# EasyEDA Pro project WEN-验证模块合集.epro, board 验证板
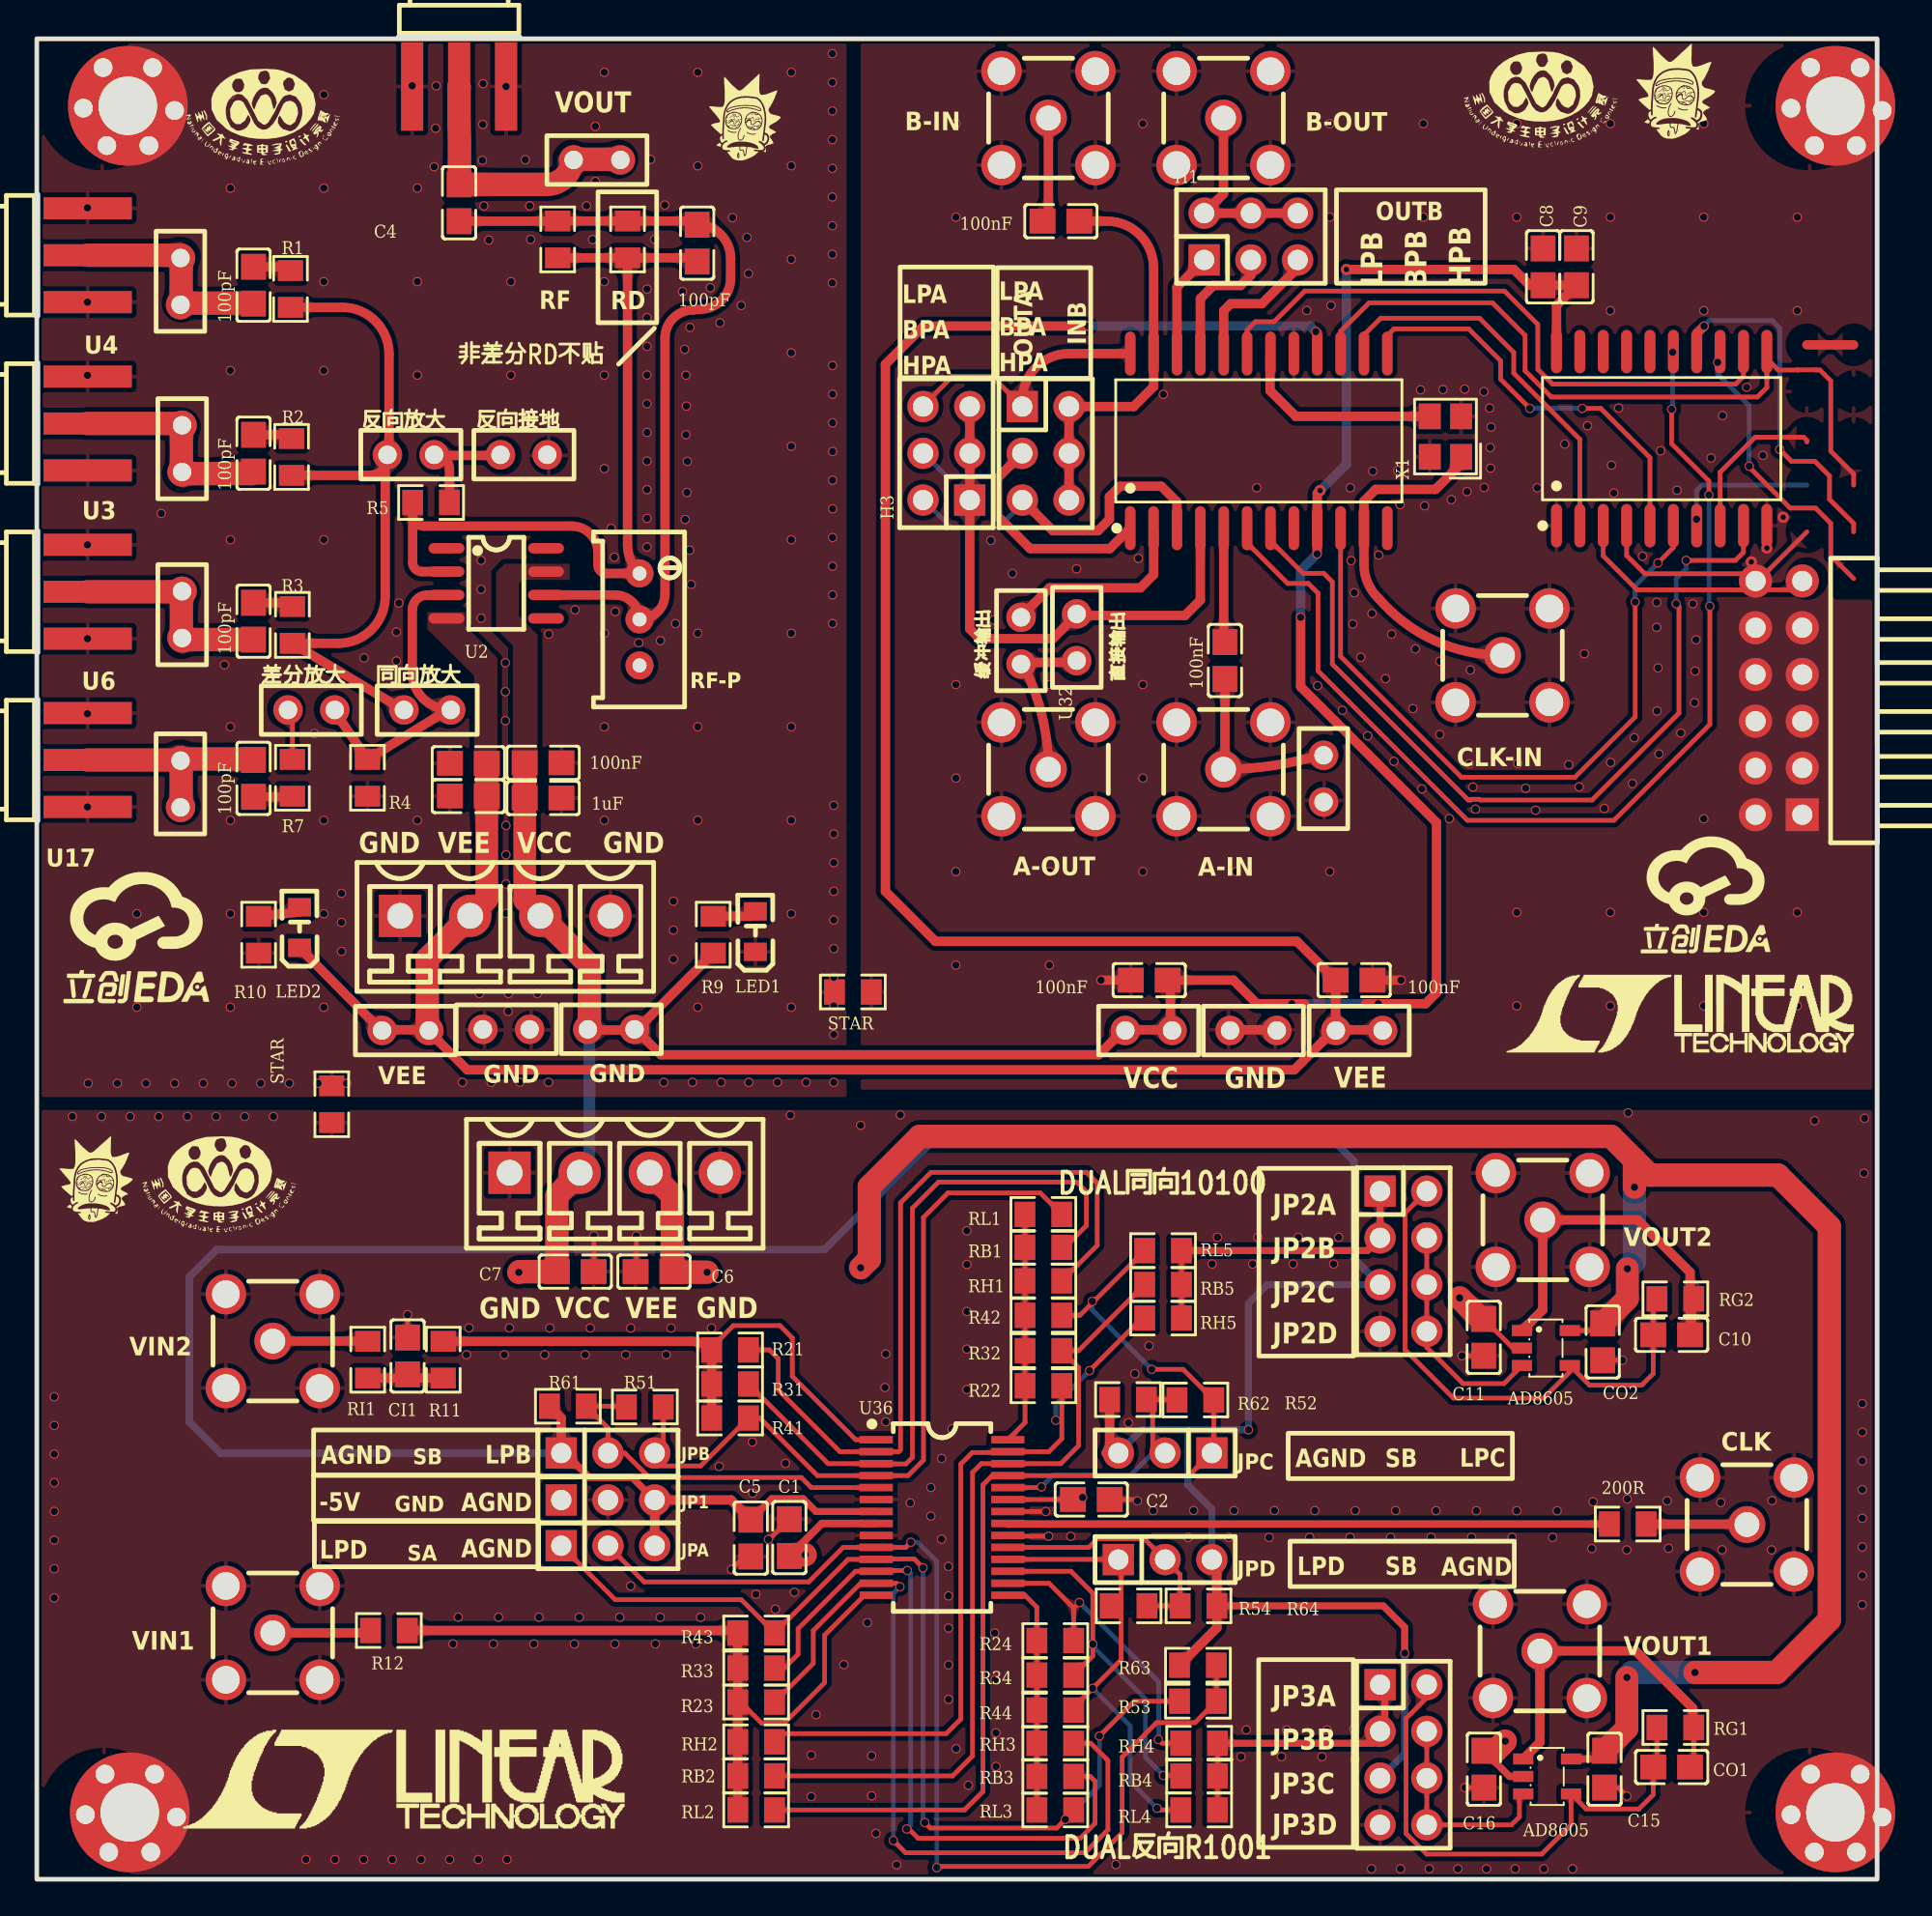
[diagram p3: board, top side]
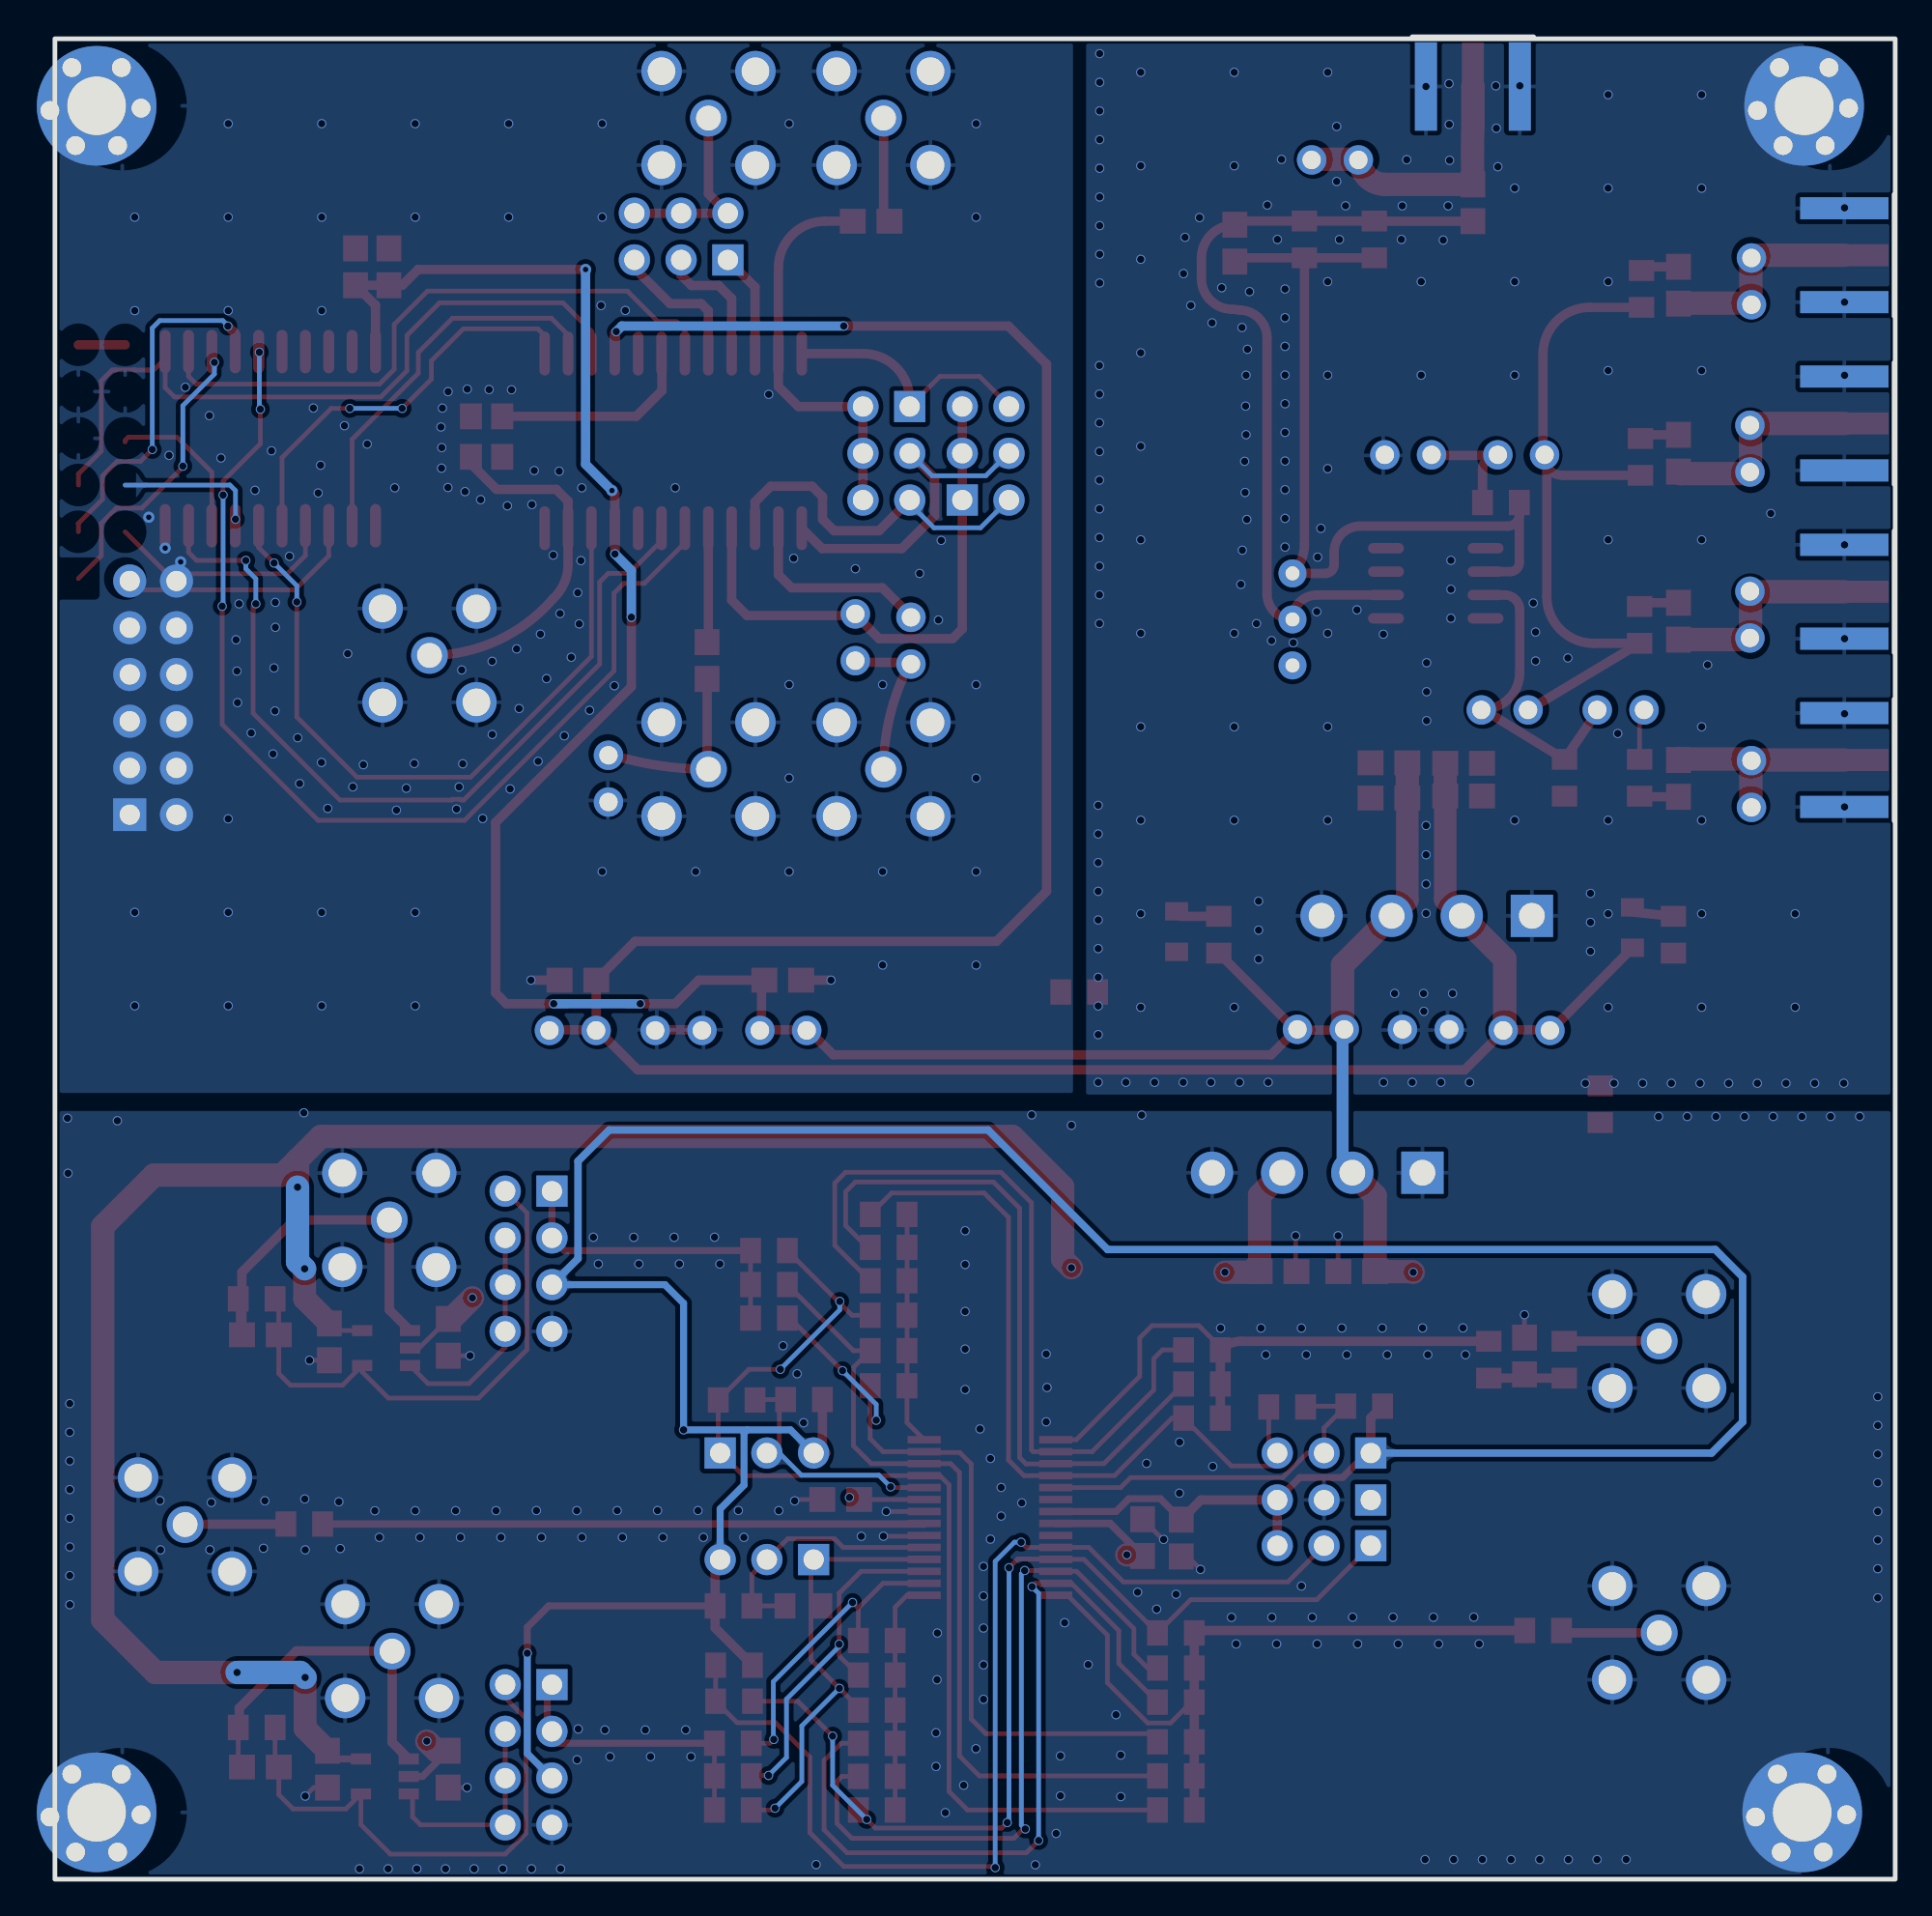
[diagram p4: board, bottom side, seen from below]

Outline 100 x 100.11 mm; copper layers: Top Layer, Inner1, Inner2, Bottom Layer. Coordinates in mm from the lower left corner of the outline.
Outline path: rectangle 0,100 100,0
Stack: Top Layer 0.035mm 外层铜厚1oz / Dielectric1 0.2104mm 7628 RC49% 8.6mil / Inner1 0.0152mm 内层铜厚 / Dielectric2 1.065mm 1.1mm H/HOZ Copper / Inner2 0.0152mm 内层铜厚 / Dielectric3 0.2104mm 7628 RC49% 8.6mil / Bottom Layer 0.035mm 外层铜厚1oz

## Design rules (mm)
template: 自定义配置
spacing copperThickness1oz (default): track to track 0.102, other pairs 0 to 0.3
spacing copperThickness2oz: track to track 0.203, other pairs 0.152 to 0.3
track width copperThickness1oz: min 0.127, default 0.254, max 2.54
track width copperThickness2oz (default): min 0.203, default 0.254, max 2.54
track width TRACE: min 0.127, default 0.508, max 2.54
differential pair differentialPair (default): width min 0.127, default 0.254, max 2.54; gap min 0.152, default 0.152
via viaSize (default): diameter min 0.5, default 0.61, max 10; hole min 0.3, default 0.305, max 6.299

## Placement (name value [footprint] x y rotation side)
1uF  1uF  [C0805]  27.51 58.75 180 top
1uF#2  1uF  [C0805]  23.45 58.86 180 top
100nF  100nF  [C0805]  27.51 60.66 180 top
100nF#2  100nF  [C0805]  23.45 60.64 180 top
100nF#3  100nF  [C0805]  60.45 48.85 180 top
100nF#4  104  [C0805]  71.58 48.85 0 top
100nF#5  100nF  [C0805]  55.65 90.09 180 top
100nF#6  -  [C0805]  64.56 66.22 90 top
100pF  100pF  [C0805]  11.78 86.61 90 top
100pF#2  100pF  [C0805]  11.78 77.48 90 top
100pF#3  100pF  [C0805]  11.78 68.36 90 top
100pF#4  100pF  [C0805]  11.78 59.81 270 top
100pF#5  100pF  [C0805]  35.88 88.9 90 top
200R  200R  [R0805]  86.45 19.3 180 top
A-IN  BWSMA-KE-Z001  [SMA-TH_BWSMA-KE-Z001]  64.48 60.31 0 top
A-OUT  BWSMA-KE-Z001  [SMA-TH_BWSMA-KE-Z001]  54.97 60.31 180 top
AD8605  -  [SOT-23-5_L3.0-W1.7-P0.95-LS2.8-BR]  82 28.86 180 top
AD8605#2  -  [SOT-23-5_L3.0-W1.7-P0.95-LS2.8-BR]  82.07 5.58 180 top
B-IN  BWSMA-KE-Z001  [SMA-TH_BWSMA-KE-Z001]  54.97 95.69 0 top
B-OUT  BWSMA-KE-Z001  [SMA-TH_BWSMA-KE-Z001]  64.48 95.69 0 top
C1  100nF  [C0805]  40.89 18.56 270 top
C2  100nF  [C0805]  57.3 20.63 180 top
C4  100pF  [C0805]  22.95 91.09 90 top
C5  10uF  [C0805]  38.8 18.54 270 top
C6  10uF  [C0805]  33.54 33.01 0 top
C7  10uF  [C0805]  29.26 33.01 0 top
C8  104  [C0805]  81.85 87.61 90 top
C9  106  [C0805]  83.67 87.61 90 top
C10  100nF  [C0805]  85.09 29.2 270 top
C11  100nF  [C0805]  78.62 29.44 270 top
C15  100nF  [C0805]  85.19 5.98 270 top
C16  100nF  [C0805]  78.63 5.98 270 top
CI1  100nF  [C0805]  20.15 28.43 270 top
CLK  BWSMA-KE-Z001  [SMA-TH_BWSMA-KE-Z001]  92.93 19.27 270 top
CLK-IN  BWSMA-KE-Z001  [SMA-TH_BWSMA-KE-Z001]  79.65 66.5 180 top
CN1  WJ15EDGVC-3.81-4P  [CONN-TH_4P-P3.81_WJ2EDGVC-3.81-4P]  25.46 52.34 0 top
CN3  WJ15EDGVC-3.81-4P  [CONN-TH_4P-P3.81_WJ2EDGVC-3.81-4P]  31.41 38.39 0 top
CO1  100nF  [C0805]  88.84 6.09 0 top
CO2  100nF  [C0805]  88.84 29.58 0 top
GND  -  [2P-2.54]  31.3 46.14 180 top
GND#2  -  [2P-2.54]  25.6 46.14 180 top
GND#3  -  [HDR-TH_3P-P2.54-V-M]  31.04 20.6 0 top
H1  PZ254V-12-6P  [HDR-TH_6P-P2.54-V-M-R2-C3-S2.54]  65.97 89.25 0 top
H3  PZ254V-12-6P  [HDR-TH_6P-P2.54-V-M-R2-C3-S2.54]  49.43 77.48 90 top
H4  PZ254V-12-8P  [HDR-TH_8P-P2.54-V-M-R2-C4-S2.54]  74.26 33.58 270 top
H6  PZ254V-12-8P  [HDR-TH_8P-P2.54-V-M-R2-C4-S2.54]  74.26 6.76 270 top
JPC  PZ254V-11-03P  [HDR-TH_3P-P2.54-V-M]  61.31 23.16 180 top
JPD  PZ254V-11-03P  [HDR-TH_3P-P2.54-V-M]  61.31 17.37 0 top
LED1  -  [LED_0805]  39.05 51.54 90 top
LED2  -  [LED_0805]  14.28 51.76 90 top
M1  max262  [SOIC-24_L15.4-W7.5-P1.27-LS10.3-BL]  66.4 78.15 0 top
N1  74HC373  [SOIC-20_L13.0-W7.6-P1.27-LS10.3-BL]  88.29 78.27 0 top
P2  Header 3X2  [HDR-TH_6P-P2.54-V-M-R2-C3-S2.54]  54.82 77.48 270 top
R1  1k  [R0805]  13.78 86.41 270 top
R2  1k  [R0805]  13.84 77.28 270 top
R3  1k  [R0805]  13.89 68.15 270 top
R4  1k  [R0805]  17.97 59.85 90 top
R5  1k  [R0805]  21.42 74.8 0 top
R7  1k  [R0805]  13.89 59.85 90 top
R9  1k  [R0805]  36.76 51.32 270 top
R10  1k  [R0805]  12.05 51.32 270 top
R11  1k  [R0805]  22.08 28.23 90 top
R12  1k  [R0805]  19.13 13.51 0 top
R21  1k  [R0805]  37.67 28.76 0 top
R22  1k  [R0805]  54.7 26.81 180 top
R23  1k  [R0805]  39.09 9.62 0 top
R24  1k  [R0805]  55.34 12.97 180 top
R31  1k  [R0805]  37.67 26.91 0 top
R32  1k  [R0805]  54.7 28.72 180 top
R33  1k  [R0805]  39.09 11.47 0 top
R34  1k  [R0805]  55.34 11.09 180 top
R41  1k  [R0805]  37.67 25.06 0 top
R42  1k  [R0805]  54.7 30.64 180 top
R43  1k  [R0805]  39.09 13.38 0 top
R44  1k  [R0805]  55.34 9.19 180 top
R51  1k  [R0805]  33.04 25.66 0 top
R52  1k  [R0805]  62.96 26.04 0 top
R53  1k  [R0805]  63.1 9.67 0 top
R54  1k  [R0805]  59.33 14.85 0 top
R61  1k  [R0805]  28.86 25.7 0 top
R62  1k  [R0805]  59.3 26.06 180 top
R63  1k  [R0805]  63.1 11.63 0 top
R64  1k  [R0805]  63.13 14.85 0 top
RB1  1k  [R0805]  54.69 34.33 180 top
RB2  1k  [R0805]  39.09 5.61 0 top
RB3  1k  [R0805]  55.34 5.58 180 top
RB4  1k  [R0805]  63.16 5.61 0 top
RB5  1k  [R0805]  61.2 32.31 0 top
RD  1k  [R0805]  32.1 89.1 90 top
RF  10k  [R0805]  28.3 89.1 90 top
RF-P  10kΩ  [RES-ADJ-TH_3P-L10.0-W10.0-P2.50-L]  32.75 68.45 270 top
RG1  1k  [R0805]  89.04 8.24 0 top
RG2  1k  [R0805]  89.04 31.53 0 top
RH1  1k  [R0805]  54.69 32.51 180 top
RH2  1k  [R0805]  39.09 7.46 0 top
RH3  1k  [R0805]  55.34 7.38 180 top
RH4  1k  [R0805]  63.16 7.39 0 top
RH5  1k  [R0805]  61.2 30.49 0 top
RI1  1k  [R0805]  17.98 28.23 270 top
RL1  1k  [R0805]  54.69 36.12 180 top
RL2  1k  [R0805]  39.09 3.76 0 top
RL3  1k  [R0805]  55.34 3.76 180 top
RL4  1k  [R0805]  63.16 3.76 0 top
RL5  1k  [R0805]  61.2 34.16 0 top
SA  PZ254V-11-03P  [HDR-TH_3P-P2.54-V-M]  31.04 18.12 0 top
SB  PZ254V-11-03P  [HDR-TH_3P-P2.54-V-M]  31.04 23.16 0 top
STAR  -  [R0805]  44.34 48.21 0 top
STAR#2  -  [R0805]  16.03 42.11 90 top
U2  OPA690IDR  [SOIC-8_L5.0-W4.0-P1.27-LS6.0-BL]  24.96 70.41 270 top
U3  -  [SMA-SMD_BWSMA-KE-P001]  2.76 79.1 180 top
U4  -  [SMA-SMD_BWSMA-KE-P001]  2.76 88.24 180 top
U6  -  [SMA-SMD_BWSMA-KE-P001]  2.76 69.96 180 top
U7  -  [SMA-SMD_BWSMA-KE-P001]  22.95 97.41 90 top
U8  -  [2P-2.54]  30.35 93.45 0 top
U12  -  [2P-2.54]  7.85 86.91 270 top
U14  -  [2P-2.54]  7.86 68.63 90 top
U15  -  [2P-2.54]  7.86 77.64 90 top
U17  -  [SMA-SMD_BWSMA-KE-P001]  2.76 60.81 180 top
U18  -  [2P-2.54]  7.85 59.6 270 top
U24  -  [My_M3螺丝孔]  96.34 96.36 0 top
U25  -  [My_M3螺丝孔]  96.34 3.63 0 top
U26  -  [My_M3螺丝孔]  3.65 3.63 0 top
U27  -  [My_M3螺丝孔]  3.55 96.36 0 top
U28  -  [2P-2.54]  60.33 46.15 0 top
U29  -  [2P-2.54]  66.02 46.15 0 top
U30  -  [2P-2.54]  71.77 46.15 0 top
U32  -  [2P-2.54]  69.96 59.89 270 top
U33  -  [PMOD2X6P-2.54mm]  98.73 70.67 90 top
U36  -  [SSOP-28_L10.2-W5.3-P0.65-LS7.8-TL]  49.19 19.65 0 top
VEE  -  [2P-2.54]  19.95 46.15 0 top
VIN1  BWSMA-KE-Z001  [SMA-TH_BWSMA-KE-Z001]  12.82 13.38 0 top
VIN2  BWSMA-KE-Z001  [SMA-TH_BWSMA-KE-Z001]  12.82 29.24 0 top
VOUT1  BWSMA-KE-Z001  [SMA-TH_BWSMA-KE-Z001]  81.68 12.39 0 top
VOUT2  BWSMA-KE-Z001  [SMA-TH_BWSMA-KE-Z001]  81.83 35.82 0 top
X1  12MHz  [CRYSTAL-SMD_4P-L3.2-W2.5-BL]  76.55 78.39 90 top
反向接地  -  [2P-2.54]  26.55 77.36 180 top
反向放大  -  [2P-2.54]  20.41 77.36 180 top
同向放大  -  [2P-2.54]  21.13 63.57 0 top
差分放大  -  [2P-2.54]  14.83 63.57 0 top
直接输出  -  [2P-2.54]  56.47 67.39 90 top
缓冲输出  -  [2P-2.54]  53.52 67.38 270 top

## Footprints (pads in the part's own frame, mm; a bottom-side part is the same pattern mirrored in y, then rotated)
2P-2.54
  round 1.6 hole 1: 1(1.357,-0.036) 2(-1.183,-0.036)
C0805
  rect 1.41x1.35 smd: 1(-1,0) 2(1,0)
CONN-TH_4P-P3.81_WJ2EDGVC-3.81-4P
  rect 2.3x2.3 hole 1.4: 1(-5.715,0)
  round 2.3 hole 1.4: 2(-1.905,0) 3(1.905,0) 4(5.715,0)
CRYSTAL-SMD_4P-L3.2-W2.5-BL
  rect 1.4x1.2 smd: 1(-1.1,-0.85) 2(1.1,-0.85) 3(1.1,0.85) 4(-1.1,0.85)
HDR-TH_3P-P2.54-V-M
  rect 1.7x1.7 hole 1.1: 1(-2.54,0)
  round 1.7 hole 1.1: 2(0,0) 3(2.54,0)
HDR-TH_6P-P2.54-V-M-R2-C3-S2.54
  rect 1.7x1.7 hole 1.1: 1(-2.54,-1.27)
  round 1.7 hole 1.1: 2(-2.54,1.27) 3(0,-1.27) 4(0,1.27) 5(2.54,-1.27) 6(2.54,1.27)
HDR-TH_8P-P2.54-V-M-R2-C4-S2.54
  rect 1.7x1.7 hole 1.1: 1(-3.81,-1.27)
  round 1.7 hole 1.1: 2(-3.81,1.27) 3(-1.27,-1.27) 4(-1.27,1.27) 5(1.27,-1.27) 6(1.27,1.27) 7(3.81,-1.27) 8(3.81,1.27)
LED_0805
  rect 1x1.25 smd: 1(-1.15,0.005) 2(1.05,0.005)
My_M3螺丝孔
  round 1.016 hole 1.021x1.016: 1(-1.016,-0.127) 1(0.051,2.078) 1(0.254,-2.159) 1(2.54,-2.159) 1(2.743,2.078) 1(3.937,-0.254)
  round 6.5 hole 3.18x3.175: 1(1.397,0)
PMOD2X6P-2.54mm
  rect 1.778x1.8 hole 1.1: 1(-12.832,2.791)
  round 1.8 hole 1.1: 2(-12.832,5.331) 3(-10.293,2.791) 4(-10.293,5.331) 5(-7.753,2.791) 6(-7.753,5.331) 7(-5.213,2.791) 8(-5.213,5.331) 9(-2.672,2.791) 10(-2.672,5.331) 11(-0.133,2.791) 12(-0.133,5.331)
R0805
  rect 1.133x1.377 smd: 1(-1,0) 2(1,0)
RES-ADJ-TH_3P-L10.0-W10.0-P2.50-L
  round 1.524 hole 0.762: 1(-2.5,0) 2(0,0) 3(2.5,0)
SMA-SMD_BWSMA-KE-P001
  rect 4.8x1.2 smd: 1(0,-2.55) 2(0,2.55) 5(0,0)
  rect 4.8x1.2 smd far side: 3(0,2.55) 4(0,-2.55)
SMA-TH_BWSMA-KE-Z001
  round 2.2 hole 1.5: 1(-2.55,-2.55) 2(-2.55,2.55) 3(2.55,2.55) 4(2.55,-2.55)
  round 2 hole 1.35: 5(0,0)
SOIC-8_L5.0-W4.0-P1.27-LS6.0-BL
  oval 0.569x1.95 smd: 1(-1.905,-2.705) 2(-0.635,-2.705) 3(0.635,-2.705) 4(1.905,-2.705) 5(1.905,2.705) 6(0.635,2.705) 7(-0.635,2.705) 8(-1.905,2.705)
SOIC-20_L13.0-W7.6-P1.27-LS10.3-BL
  oval 0.595x2.36 smd: 1(-5.715,-4.73) 2(-4.445,-4.73) 3(-3.175,-4.73) 4(-1.905,-4.73) 5(-0.635,-4.73) 6(0.635,-4.73) 7(1.905,-4.73) 8(3.175,-4.73) 9(4.445,-4.73) 10(5.715,-4.73) 11(5.715,4.73) 12(4.445,4.73) 13(3.175,4.73) 14(1.905,4.73) 15(0.635,4.73) 16(-0.635,4.73) 17(-1.905,4.73) 18(-3.175,4.73) 19(-4.445,4.73) 20(-5.715,4.73)
SOIC-24_L15.4-W7.5-P1.27-LS10.3-BL
  oval 0.574x2.388 smd: 1(-6.985,-4.744) 2(-5.715,-4.744) 3(-4.445,-4.744) 4(-3.175,-4.744) 5(-1.905,-4.744) 6(-0.635,-4.744) 7(0.635,-4.744) 8(1.905,-4.744) 9(3.175,-4.744) 10(4.445,-4.744) 11(5.715,-4.744) 12(6.985,-4.744) 13(6.985,4.744) 14(5.715,4.744) 15(4.445,4.744) 16(3.175,4.744) 17(1.905,4.744) 18(0.635,4.744) 19(-0.635,4.744) 20(-1.905,4.744) 21(-3.175,4.744) 22(-4.445,4.744) 23(-5.715,4.744) 24(-6.985,4.744)
SOT-23-5_L3.0-W1.7-P0.95-LS2.8-BR
  rect 1.1x0.6 smd: 1(1.3,-0.95) 2(1.3,0) 3(1.3,0.95) 4(-1.3,0.95) 5(-1.3,-0.95)
SSOP-28_L10.2-W5.3-P0.65-LS7.8-TL
  rect 1.804x0.406 smd: 1(-3.575,4.225) 2(-3.575,3.575) 3(-3.575,2.925) 4(-3.575,2.275) 5(-3.575,1.625) 6(-3.575,0.975) 7(-3.575,0.325) 8(-3.575,-0.325) 9(-3.575,-0.975) 10(-3.575,-1.625) 11(-3.575,-2.275) 12(-3.575,-2.925) 13(-3.575,-3.575) 14(-3.575,-4.225) 15(3.575,-4.225) 16(3.575,-3.575) 17(3.575,-2.925) 18(3.575,-2.275) 19(3.575,-1.625) 20(3.575,-0.975) 21(3.575,-0.325) 22(3.575,0.325) 23(3.575,0.975) 24(3.575,1.625) 25(3.575,2.275) 26(3.575,2.925) 27(3.575,3.575) 28(3.575,4.225)

## Nets
3V3: U33.11 U33.12
+5V: 1uF.2 100nF.2 100nF#3.1 AD8605.5 AD8605#2.5 C1.2 C7.1 C8.1 C9.1 C10.1 C15.1 CN1.3 CN3.2 GND.1 GND.2 M1.9 N1.20 R9.2 U2.7 U28.1 U28.2 U36.8
-5V: 1uF#2.1 100nF#2.1 100nF#4.1 AD8605.2 AD8605#2.2 C2.2 C6.2 C11.1 C16.1 CN1.2 CN3.3 GND#3.1 LED2.1 M1.16 U2.4 U30.1 U30.2 U36.23 VEE.1 VEE.2
AGND: C5.1 GND#3.3 H4.5 H6.5 JPC.3 JPD.3 R61.1 R62.2 R63.1 R64.2 SA.3 SB.1 U36.7
GND: 1uF.1 1uF#2.2 100nF.1 100nF#2.2 100nF#3.2 100nF#4.2 A-IN.1 A-IN.2 A-IN.3 A-IN.4 A-OUT.1 A-OUT.2 A-OUT.3 A-OUT.4 B-IN.1 B-IN.2 B-IN.3 B-IN.4 B-OUT.1 B-OUT.2 B-OUT.3 B-OUT.4 C1.1 C2.1 C5.2 C6.1 C7.2 C8.2 C9.2 C10.2 C11.2 C15.2 C16.2 CI1.1 CLK.1 CLK.2 CLK.3 CLK.4 CLK-IN.1 CLK-IN.2 CLK-IN.3 CLK-IN.4 CN1.1 CN1.4 CN3.1 CN3.4 GND#2.1 GND#2.2 GND#3.2 H4.7 H6.7 LED1.1 M1.17 N1.1 N1.10 R4.1 R10.2 STAR.1 STAR.2 STAR#2.1 STAR#2.2 U3.1 U3.2 U3.3 U3.4 U4.1 U4.2 U4.3 U4.4 U6.1 U6.2 U6.3 U6.4 U7.1 U7.2 U7.3 U7.4 U17.1 U17.2 U17.3 U17.4 U24.1 U25.1 U26.1 U27.1 U29.1 U29.2 U32.1 U33.7 U33.9 U33.10 U36.6 U36.9 U36.20 U36.22 VIN1.1 VIN1.2 VIN1.3 VIN1.4 VIN2.1 VIN2.2 VIN2.3 VIN2.4 VOUT1.1 VOUT1.2 VOUT1.3 VOUT1.4 VOUT2.1 VOUT2.2 VOUT2.3 VOUT2.4 X1.2 X1.4 反向接地.2
VIN1: R12.1 VIN1.5
VIN2: RI1.1 VIN2.5
A0: M1.14 N1.2
A1: M1.13 N1.5
A2: M1.10 N1.6
A3: M1.7 N1.9
D0: M1.19 N1.12
D1: M1.6 N1.15
IN-D0: N1.3 U33.2
IN-D1: N1.4 U33.4
IN-D2: N1.7 U33.6
IN-D3: N1.8 U33.8
IN-D4: N1.13 U33.1
IN-D5: N1.14 U33.3
IN-WR: M1.15 N1.11 U33.5
OP-IN: H3.1 H3.3 H3.5 M1.4 直接输出.1
OP-OUT: M1.2 缓冲输出.2
$1N2485: 100pF#5.1 R5.1 RD.1 RF.1 RF-P.1 U2.2
$1N2698: 100pF.1 U4.5 U12.1 U12.2
$1N2704: 100pF.2 R1.1
$1N2710: 100pF#2.2 R2.1
$1N2715: 100pF#2.1 U3.5 U15.1 U15.2
$1N2721: 100pF#3.1 U6.5 U14.1 U14.2
$1N2730: 100pF#3.2 R3.1
$1N2778: R4.2 U2.3 同向放大.1 差分放大.1
$1N2863: R5.2 反向接地.1 反向放大.2
$1N2871: R1.2 R2.2 R3.2 反向放大.1 同向放大.2
$1N3268: C4.2 U7.5 U8.1 U8.2
$1N3280: 100pF#5.2 C4.1 RD.2 RF.2 RF-P.2 U2.6
$1N3511: 100pF#4.1 U17.5 U18.1 U18.2
$1N3515: 100pF#4.2 R7.1
$1N3520: R7.2 差分放大.2
$1N3998: LED1.2 R9.1
$1N4082: LED2.2 R10.1
$2N1385: H3.2 M1.3 P2.5
$2N1386: H3.6 M1.24 P2.1
$2N1387: H3.4 M1.1 P2.3
$2N1398: H1.5 M1.20
$2N1399: H1.3 M1.21
$2N1463: M1.18 X1.3
$2N4736: H1.1 M1.22
$2N4759: B-OUT.5 H1.2 H1.4 H1.6
$2N7298: A-OUT.5 直接输出.2 缓冲输出.1
$2N7530: 100nF#5.2 B-IN.5
$2N7539: 100nF#5.1 M1.23 P2.2 P2.4 P2.6
$2N7543: CLK-IN.5 M1.11 X1.1
$2N8327: 100nF#6.1 A-IN.5 U32.2
$2N8341: 100nF#6.2 M1.5
$3N1782: R22.2 R32.2 R42.2 RB1.2 RH1.2 RL1.2 U36.28
$3N1872: JPC.1 R42.1 R52.2 RL2.2 RL5.1 U36.25
$3N1876: R32.1 RB2.2 RB5.1 U36.26
$3N1878: R22.1 RH2.2 RH5.1 U36.27
$3N2477: AD8605.1 CO2.2 RG2.2 VOUT2.5
$3N2576: AD8605.4 CO2.1 H4.2 RG2.1
$3N2792: H4.1 H4.3 RB5.2 RH5.2 RL5.2
$3N2807: AD8605.3 H4.4 H4.6 H4.8
$3N3003: R21.2 RH1.1 U36.2
$3N3008: R31.2 RB1.1 U36.3
$3N3018: R41.2 R51.2 RL1.1 SB.3 U36.4
$3N3022: R11.2 R21.1 R31.1 R41.1 U36.1
$3N3099: CI1.2 R11.1 RI1.2
$3N3340: R51.1 R61.2 SB.2 U36.5
$3N3779: R53.2 R63.2 SA.2 U36.10
$3N4162: R43.2 R53.1 RL3.1 SA.1 U36.11
$3N4167: R33.2 RB3.1 U36.12
$3N4172: R23.2 RH3.1 U36.13
$3N4596: R24.2 R34.2 R44.2 RB3.2 RH3.2 RL3.2 U36.15
$3N4603: JPD.1 R44.1 R54.1 RL4.1 U36.18
$3N4605: R24.1 RH4.1 U36.16
$3N4661: R34.1 RB4.1 U36.17
$3N4969: 200R.2 U36.21
$3N4977: JPD.2 R54.2 R64.1 U36.19
$3N5437: AD8605#2.1 CO1.2 RG1.2 VOUT1.5
$3N5450: AD8605#2.4 CO1.1 H6.2 RG1.1
$3N5465: AD8605#2.3 H6.4 H6.6 H6.8
$3N5493: H6.1 H6.3 RB4.2 RH4.2 RL4.2
$3N5834: 200R.1 CLK.5
$3N6100: JPC.2 R52.1 R62.1 U36.24
$3N6540: R12.2 R23.1 R33.1 R43.1 RB2.1 RH2.1 RL2.1 U36.14

Pads without a net: M1 8 12; N1 16 17 18 19; RF-P 3; U2 1 5 8

## Via types
v1: diameter 0.5, hole 0.4, Top Layer to Bottom Layer, 545 vias
v2: diameter 0.61, hole 0.305, Top Layer to Bottom Layer, 5 vias

## Routing (per net, layer and track width the routed paths; a pad name or vN(x,y) marks a point on that pad's centre or on a via; arc(x,y) is an arc through that point)
3V3: length 2.5
  Top Layer w0.508: 96.19,83.37 98.73,83.37
+5V: length 303.6
  Top Layer w0.254: AD8605.5 84.7,29.81 C10.1
  Top Layer w0.381: 83.37,6.53 84.74,6.53 C15.1
  Top Layer w0.406: U36.8 42.66,19.33 40.96,17.63
  Top Layer w0.508: 32.57,46.14 32.58,46.14 R9.2 ; 32.57,46.14 30.03,46.14 ; 32.57,46.14 33.91,44.8 57.71,44.8 59.06,46.15 61.6,46.15 61.6,48.7 100nF#3.1 65.02,48.85 66.3,47.57 v1(68.19,47.57) 68.89,47.57 ; v2(69.73,75.45) 69.58,75.3 M1.9 69.57,73.4 v1(69.57,72.01) ; N1.20 82.58,85.52 C9.1 C8.1 81.12,86.61 80.26,87.47 v2(71.16,87.47) ; v1(68.68,68.57) 68.68,64.8 76.06,57.42 76.06,48.16 75.46,47.57 v1(72.9,47.57) 72.21,47.57
  Top Layer w1.23: CN1.3 26.51,53.2 1uF.2
  Top Layer w1.244: C10.1 86.43,31.54 v1(86.43,33.17) ; C15.1 86.4,8.19 v1(86.4,10.96)
  Top Layer w1.27: v1(41.75,17.63) 40.96,17.63 C1.2 ; 86.81,39.09 85.55,40.36 47.97,40.36 45.24,37.62 45.24,33.69 v1(44.77,33.22) ; 86.81,39.09 87.64,38.26 94.61,38.26 97.4,35.47 97.4,14.1 94.54,11.23 v1(90.1,11.23) ; 86.81,39.09 v1(86.81,37.6) ; 30.03,46.14 30.03,49.68 CN1.3 ; CN3.2 28.26,37.14 C7.1 26.23,33.01 v1(26.19,32.97) ; 1uF.2 100nF.2
  Inner2 w1.27: v1(26.19,32.97) 28.04,31.13 42.67,31.13 ; 42.67,31.13 42.98,31.13 43.99,30.12 43.99,19.86 v1(41.75,17.63) ; 42.67,31.13 v1(44.77,33.22)
  Bottom Layer w0.508: v1(68.19,47.57) v1(72.9,47.57) ; v2(69.73,75.45) 71.16,76.89 v2(71.16,87.47) ; v1(69.57,72.01) 68.68,71.12 v1(68.68,68.57)
  Bottom Layer w0.65: CN3.2 30.03,38.91 30.03,46.14
  Bottom Layer w1.27: v1(86.81,37.6) 86.81,33.55 v1(86.43,33.17) ; v1(86.4,10.96) 86.67,11.23 v1(90.1,11.23)
-5V: length 415.1
  Top Layer w0.254: 52.77,20.63 56.3,20.63 C2.2 ; AD8605.2 80.21,28.86 C11.1
  Top Layer w0.381: AD8605#2.2 80.03,5.58 C16.1
  Top Layer w0.508: 70.5,46.15 70.58,46.23 100nF#4.1 68.47,50.96 48.83,50.96 46.11,53.68 46.11,82.32 48.19,84.39 v1(57.13,84.39) ; 70.5,46.15 73.04,46.15 ; 70.5,46.15 68.33,43.98 23.39,43.98 21.22,46.15 18.68,46.15 LED2.1 ; v1(69.5,84.09) 69.58,84.01 M1.16
  Top Layer w1.23: 1uF#2.1 24.45,53.24 CN1.2
  Top Layer w1.27: C11.1 78.46,30.44 v1(77.31,31.59) ; CN1.2 21.22,50.01 21.22,46.15 ; v1(79.79,7.5) 79.76,7.47 arc(79.66,7.39) 79.58,7.3 79.27,6.98 C16.1 ; v1(36.42,32.98) 34.57,32.98 C6.2 34.54,37.16 CN3.3 ; 1uF#2.1 100nF#2.1
  Inner2 w0.65: 21.22,46.15 21.22,40.64
  Inner2 w1.27: v1(79.79,7.5) 80.24,7.96 85.31,7.96 86.73,9.38 96.34,9.38 98.15,11.19 98.15,37.5 95.05,40.61 78.44,40.61 77.68,39.85 76.38,39.85 ; 44.42,39.18 45.08,39.85 56.98,39.85 57.03,39.8 ; 44.42,39.18 38.22,32.98 v1(36.42,32.98) ; 44.42,39.18 43.24,40.36 4.02,40.36 2.47,38.8 2.47,21.82 3.68,20.6 GND#3.1 ; 76.38,39.85 76.38,39.8 57.03,39.8 ; 76.38,39.85 77.31,38.91 v1(77.31,31.59) ; 57.03,39.8 58.45,38.38 58.45,27.03 56.83,25.41 v1(56.83,20.74)
  Bottom Layer w0.508: v1(57.13,84.39) 69.2,84.39 v1(69.5,84.09)
AGND: length 186.9
  Top Layer w0.381: R64.2 73.17,14.85 74.33,13.69 v1(74.33,12.28) ; SB.1 28.7,23.16 30.03,21.82 32.36,21.82 GND#3.3 ; C5.1 39.93,20.67 41.64,20.67 42.34,19.98 U36.7
  Top Layer w0.508: 58.1,23.16 58.3,23.35 R62.2 ; R61.1 28.5,25.06 SB.1 ; C5.1 37.73,20.6 GND#3.3 SA.3 ; JPD.3 64.13,17.09 R64.2 64.13,13.66 R63.1
  Bottom Layer w0.381: H6.5 74.33,6.83 v1(74.33,12.28) ; 62.38,24.41 v1(65.84,24.41) 65.84,31.29 66.85,32.31 H4.5 ; 62.38,24.41 60.03,24.41 JPC.3 ; 62.38,24.41 62.55,24.24 62.55,21.42 63.85,20.12 JPD.3
  Bottom Layer w0.406: SB.1 9.98,23.16 8.29,24.84 8.29,32.73 9.78,34.21 42.8,34.21 49.29,40.71 69.88,40.71 71.58,39.02 71.58,33.72 H4.5
GND: length 25.5
  Top Layer w0.254: C2.1 59.73,20.63 v1(59.8,20.56) ; C6.1 32.58,33.06 v1(32.58,34.96) ; C15.2 85.94,4.98 v1(86.4,4.51) ; C5.2 38.52,17.26 38.18,17.26 v1(37.75,16.83) ; v1(39.75,18.46) 39.79,18.46 C1.1 ; C16.2 v1(77.61,4.98) ; 52.77,18.68 52.81,18.64 v1(54.98,18.64) ; CI1.1 v1(20.15,30.67) ; C10.2 v1(86.16,28.2) ; v1(30.27,34.96) 30.27,33.03 C7.2 ; C11.2 v1(77.44,28.44) ; 52.77,19.98 v1(54.83,19.98)
  Top Layer w0.508: 100nF#4.2 v1(74.13,48.85) ; 64.75,46.15 67.29,46.15 ; N1.10 v2(94.01,72.33) ; 100nF#3.2 v1(57.83,48.85)
  vias: v1(0.95,26.22) v1(0.95,24.66) v1(0.95,23.1) v1(0.95,21.54) v1(0.95,19.98) v1(0.95,18.43) v1(0.95,16.87) v1(0.95,15.29) v1(1.93,41.44) v1(2.75,90.82) v1(2.75,85.69) v1(2.75,81.72) v1(2.75,72.51) v1(2.75,67.41) v1(2.75,63.33) v1(2.75,58.26) v1(2.79,43.25) v1(3.51,41.44) v1(4.38,43.25) v1(5.07,41.44) v1(5.44,52.46) v1(5.44,47.38) v1(5.93,43.25) v1(6.63,41.44) v1(6.76,74.21) v1(7.49,43.25) v1(8.18,41.44) v1(9.05,43.25) v1(9.74,41.44) v1(10.2,65.98) v1(10.52,96.96) v1(10.52,91.88) v1(10.52,81.97) v1(10.52,72.78) v1(10.52,62.62) v1(10.52,57.54) v1(10.52,52.46) v1(10.52,47.38) v1(10.61,43.25) v1(11.3,41.44) v1(12.16,43.25) v1(12.86,41.44) v1(13.72,43.25) v1(14.62,1.07) v1(15.08,62.25) v1(15.28,43.25) v1(15.6,96.96) v1(15.6,91.88) v1(15.6,86.8) v1(15.6,81.97) v1(15.6,72.78) v1(15.6,57.54) v1(15.6,52.46) v1(15.6,47.38) v1(16.2,1.07) v1(16.56,53.57) v1(16.56,51.99) v1(16.56,50.42) v1(16.84,43.25) v1(17.79,66.36) v1(17.76,1.07) v1(19.32,1.07) v1(19.54,67.77) v1(19.54,66.19) v1(19.67,69.34) v1(20.4,97.45) v1(20.68,91.88) v1(20.68,86.8) v1(20.68,81.72) v1(20.68,57.54) v1(20.88,1.07) v1(21.59,93.05) v1(21.67,95.14) v1(21.7,97.45) v1(22.43,1.07) v1(22.61,12.78) v1(22.9,14.24) v1(23.13,43.3) v1(23.35,28.5) v1(23.49,29.96) v1(23.99,1.07) v1(24.05,48.13) v1(24.14,71.66) v1(24.14,70.09) v1(24.14,68.51) v1(24.24,97.56) v1(24.23,95.35) v1(24.21,93.4) v1(24.29,90.92) v1(24.56,89.06) v1(24.69,43.3) v1(24.81,12.78) v1(25.09,14.24) v1(25.4,28.5) v1(25.5,97.41) v1(25.46,66.1) v1(25.46,64.52) v1(25.46,62.95) v1(25.49,57.25) v1(25.49,55.66) v1(25.49,54.07) v1(25.49,52.48) v1(25.55,1.07) v1(25.63,48.13) v1(25.61,47.16) v1(25.68,29.95) v1(25.76,86.8) v1(25.76,81.72) v1(26.25,43.3) v1(26.54,93.43) v1(26.78,90.92) v1(26.83,89.1) v1(27.01,12.78) v1(27.2,48.13) v1(27.29,14.24) v1(27.6,28.5) v1(27.8,43.3) v1(27.81,67.65) v1(27.88,29.95) v1(29.25,68.97) v1(29.21,12.78) v1(29.48,14.24) v1(29.8,28.5) v1(29.87,90.93) v1(30.07,29.95) v1(30.2,89.09) v1(30.35,95.24) v1(30.35,92.25) v1(30.84,98.18) v1(30.84,86.8) v1(30.84,81.72) v1(30.84,76.64) v1(30.84,67.7) v1(30.84,62.62) v1(30.84,57.54) v1(31.21,73.4) v1(31.38,71.84) v1(31.43,68.87) v1(31.41,12.78) v1(31.68,14.23) v1(32,28.5) v1(32.27,29.95) v1(32.27,15.93) v1(32.71,67.18) v1(33.16,86.4) v1(33.16,84.84) v1(33.16,83.29) v1(33.16,81.73) v1(33.16,80.17) v1(33.16,78.61) v1(33.16,77.06) v1(33.16,75.5) v1(33.16,73.94) v1(33.16,72.38) v1(33.35,93.45) v1(33.57,89.1) v1(33.61,12.78) v1(33.89,67.3) v1(33.87,14.23) v1(34.07,43.3) v1(34.12,90.97) v1(34.2,28.5) v1(34.46,29.95) v1(34.59,53.14) v1(34.59,51.57) v1(34.59,49.99) v1(34.71,68.22) v1(35.09,86.26) v1(35.2,83.13) v1(35.27,81.72) v1(35.3,80.04) v1(35.27,78.49) v1(35.23,73.88) v1(35.35,77.04) v1(35.33,75.35) v1(35.49,84.31) v1(35.48,72.21) v1(35.56,70.35) v1(35.63,43.3) v1(35.81,12.78) v1(35.92,98.18) v1(35.92,93.1) v1(35.92,67.7) v1(35.92,62.62) v1(35.92,57.54) v1(35.92,47.38) v1(36.07,14.23) v1(36.6,86.47) v1(36.66,29.94) v1(37.08,22.43) v1(37.12,84.57) v1(37.19,43.3) v1(37.8,90.29) v1(38.27,85.51) v1(38.59,89.21) v1(38.67,87.24) v1(38.69,43.3) v1(38.88,23.75) v1(38.9,20.98) v1(39.08,15.48) v1(40.13,14.67) v1(40.25,43.3) v1(40.68,22.59) v1(41,98.18) v1(41,93.1) v1(41,88.02) v1(41,82.94) v1(41,77.86) v1(41,72.78) v1(41,67.7) v1(41,62.62) v1(41,57.54) v1(41,52.46) v1(41,47.38) v1(40.95,41.52) v1(41.17,15.59) v1(41.8,43.3) v1(42.08,6.74) v1(42.08,4.49) v1(42.34,8.94) v1(43.23,99.19) v1(43.23,97.64) v1(43.23,96.08) v1(43.23,94.52) v1(43.23,92.96) v1(43.23,91.41) v1(43.23,89.85) v1(43.23,88.29) v1(43.23,86.73) v1(43.24,82.25) v1(43.24,80.69) v1(43.24,79.13) v1(43.24,77.57) v1(43.24,76.02) v1(43.24,74.46) v1(43.24,72.9) v1(43.24,71.34) v1(43.24,69.79) v1(43.24,68.23) v1(43.31,58.35) v1(43.31,56.79) v1(43.31,55.24) v1(43.31,53.68) v1(43.31,52.12) v1(43.31,50.56) v1(43.31,49.01) v1(43.31,47.45) v1(43.31,45.89) v1(43.31,43.3) v1(43.86,11.66) v1(44.77,40.96) v1(45.13,13.94) v1(45.36,6.7) v1(45.36,4.53) v1(45.59,2.49) v1(46.09,26.72) v1(46.13,28.54) v1(46.13,24.85) v1(46.72,0.78) v1(46.92,41.53) v1(47.46,20.45) v1(48.58,21.28) v1(48.58,19.73) v1(49.17,22.86) v1(49.17,18.48) v1(49.54,17) v1(49.54,15.39) v1(49.54,13.65) v1(49.54,11.65) v1(49.54,9.77) v1(49.73,24.46) v1(49.94,95.39) v1(49.94,90.31) v1(49.94,64.91) v1(49.94,59.83) v1(49.94,54.75) v1(49.94,49.67) v1(49.95,7.09) v1(50.54,35.23) v1(50.54,33.4) v1(50.54,30.85) v1(50.54,28.81) v1(50.54,26.61) v1(50.62,5.1) v1(51.61,3.61) v1(51.84,72.75) v1(51.99,68.42) v1(52.05,13.38) v1(52.07,10.84) v1(52.12,7.96) v1(52.12,6.13) v1(53.01,70.95) v1(55.02,64.91) v1(55.02,54.75) v1(55.02,49.67) v1(56.18,18.63) v1(56.5,71.2) v1(58.64,0.79) v1(59.32,24.8) v1(59.67,27.46) v1(59.86,71.77) v1(60.1,95.39) v1(60.1,64.91) v1(60.1,59.83) v1(60.1,54.75) v1(60.43,28.99) v1(60.67,20.03) v1(61.21,80.68) v1(62.56,18.58) v1(62.86,20.03) v1(63.87,33.43) v1(64.16,34.88) v1(64.76,18.58) v1(65.06,20.03) v1(65.18,54.75) v1(65.44,6.66) v1(65.72,8.11) v1(66.07,33.43) v1(66.29,75.6) v1(66.35,34.88) v1(66.96,18.58) v1(67.25,20.03) v1(67.64,6.66) v1(67.92,8.11) v1(68.27,33.43) v1(68.55,34.88) v1(69.01,85.24) v1(69.16,18.58) v1(69.45,20.03) v1(69.6,64.85) v1(69.84,6.66) v1(70.11,8.11) v1(70.26,95.39) v1(70.26,90.31) v1(70.26,54.75) v1(70.33,85.51) v1(70.47,33.43) v1(70.74,34.88) v1(70.95,63.51) v1(71.37,75.6) v1(71.36,18.58) v1(71.42,71.65) v1(71.59,69.9) v1(71.51,68.21) v1(71.56,8.16) v1(71.64,20.03) v1(71.63,6.49) v1(71.94,66.4) v1(72.32,62.13) v1(72.6,76.5) v1(72.55,68.77) v1(72.52,0.57) v1(72.92,71.95) v1(73.28,65.23) v1(73.56,18.58) v1(73.62,67.65) v1(73.74,60.74) v1(73.84,20.03) v1(73.95,76.54) v1(74.08,74.69) v1(74.1,0.56) v1(74.78,63.61) v1(74.91,66.85) v1(75.19,80.93) v1(75.26,59.24) v1(75.34,95.39) v1(75.34,90.31) v1(75.41,74.62) v1(75.66,0.56) v1(75.77,18.58) v1(76.03,20.02) v1(76.24,66.17) v1(76.24,62.2) v1(76.41,80.94) v1(76.75,57.63) v1(76.87,74.96) v1(77.22,0.56) v1(77.59,80.96) v1(77.72,75.39) v1(77.9,65.71) v1(77.84,60.6) v1(77.97,18.58) v1(78.03,59.35) v1(78.18,58.15) v1(78.23,20.02) v1(78.63,80.83) v1(78.64,75.62) v1(78.78,0.56) v1(78.95,79.93) v1(78.98,77.79) v1(78.99,76.67) v1(79.02,78.91) v1(80.17,18.58) v1(80.33,0.56) v1(80.42,95.39) v1(80.42,90.31) v1(80.47,60.62) v1(80.42,52.54) v1(80.42,47.46) v1(80.42,20.02) v1(80.9,59.28) v1(81.44,58.09) v1(81.53,75.6) v1(81.89,0.56) v1(82.37,18.58) v1(82.62,20.02) v1(83.03,77.98) v1(83.24,60.56) v1(83.45,0.56) v1(83.81,59.35) v1(84.09,66.59) v1(84.27,78.98) v1(84.5,17.97) v1(84.57,20.51) v1(85.17,58.18) v1(85.5,95.39) v1(85.5,90.31) v1(85.5,85.23) v1(85.5,52.54) v1(85.5,47.46) v1(85.56,76.83) v1(85.52,60.68) v1(85.7,75.32) v1(85.96,79.94) v1(86.4,17.89) v1(86.47,41.64) v1(86.42,20.66) v1(86.7,59.53) v1(86.81,62.02) v1(87.25,71.88) v1(88.02,69.38) v1(88.02,68.02) v1(88.1,65.82) v1(88.04,63.48) v1(88.15,61.14) v1(88.23,77.61) v1(88.59,20.56) v1(88.67,17.98) v1(89.13,75.47) v1(89.33,62.28) v1(89.99,69.3) v1(90.08,63.93) v1(90.16,67.34) v1(90.11,65.64) v1(90.58,95.39) v1(90.58,90.31) v1(90.58,85.23) v1(90.58,57.62) v1(90.58,52.54) v1(90.58,47.46) v1(90.98,77.22) v1(91.5,20.47) v1(91.6,79.53) v1(91.58,17.9) v1(92.91,81.07) v1(93.8,77.37) v1(94.29,20.57) v1(94.26,17.89) v1(95.66,90.31) v1(95.66,85.23) v1(95.66,67.78) v1(95.66,62.7) v1(95.66,57.62) v1(95.66,52.54) v1(95.66,47.46) v1(96.61,41.21) v1(99.19,25.84) v1(99.19,24.28) v1(99.19,22.73) v1(99.19,21.17) v1(99.19,19.61) v1(99.19,18.05) v1(99.19,16.5) v1(99.19,14.91) v1(99.29,38.36) v1(99.32,41.35) v2(93.17,71.58) v2(94.9,74)
VIN1: length 5.5
  Top Layer w0.508: 12.82,13.39 17.53,13.39 arc(17.95,13.42) 18.35,13.51
VIN2: length 5.5
  Top Layer w0.508: 12.82,29.24 18.27,29.24 18.29,29.23
A0: length 21.2
  Top Layer w0.254: M1.14 72.12,83.91 73.02,84.82 78.39,84.82 80.26,82.96 80.26,81.83 83.85,78.23 N1.2
A1: length 22.6
  Top Layer w0.254: 73.39,82.9 73.39,83.87 73.75,84.24 77.81,84.24 79.54,82.5 79.54,81.51 v1(81.13,79.92) ; N1.5 87.66,77.24 84.98,79.92 v1(83.98,79.92)
  Bottom Layer w0.254: v1(83.98,79.92) v1(81.13,79.92)
A2: length 38.3
  Top Layer w0.254: M1.10 70.85,66.44 77.41,59.88 83.58,59.88 86.85,63.15 v1(86.85,69.4) ; 88.93,73.54 88.93,72.36 v1(88.09,71.52)
  Bottom Layer w0.254: v1(86.85,69.4) 86.85,70.28 v1(88.09,71.52)
A3: length 46.6
  Top Layer w0.254: N1.9 92.74,72.1 92.3,71.66 v1(89.63,71.66) ; v1(89.08,69.3) 89.23,69.15 89.23,63.36 84.51,58.64 78.43,58.64 78.4,58.68 77.96,58.68 77.92,58.64 77.78,58.64 70.4,66.02 70.4,70.49 69.93,70.95 68.81,70.95 67.19,72.58 67.19,73.26 M1.7
  Bottom Layer w0.254: v1(89.63,71.66) 89.63,71.2 89.08,70.66 v1(89.08,69.3)
D0: length 34.2
  Top Layer w0.254: N1.12 92.74,81.66 92.32,81.24 82.36,81.24 81.56,82.04 81.56,84.48 79.75,86.29 68.89,86.29 67.23,84.63 66.22,84.63 65.77,84.17 65.77,82.9
D1: length 57.9
  Top Layer w0.254: v1(90.86,75.21) 90.86,75.97 88.84,77.99 v1(88.84,79.87) ; v1(90.91,69.17) 90.91,62.75 85.7,57.53 77.74,57.53 69.62,65.65 69.62,69.88 69.09,70.41 67.97,70.41 65.77,72.61 65.77,73.41
  Bottom Layer w0.254: v1(90.91,69.17) 90.86,69.22 v1(90.86,75.21) ; v1(88.84,79.87) 88.89,79.93 v1(88.89,82.97)
IN-D0: length 13.7
  Top Layer w0.254: 96.19,70.67 95.58,70.06 86.96,70.06 85.12,71.9 N1.3
IN-D1: length 12.8
  Top Layer w0.254: 96.19,73.21 93.91,70.93 87.38,70.93 86.39,71.92 N1.4
IN-D2: length 7.7
  Bottom Layer w0.254: 96.19,75.75 90.49,75.75 90.19,75.45 v1(90.19,73.89)
IN-D3: length 8.6
  Top Layer w0.254: N1.8 91.47,76.45 93.37,78.35 96.01,78.35 96.19,78.17 96.19,78.1
IN-D4: length 15.5
  Top Layer w0.254: 93.07,76.71 95.28,74.5 96.66,74.5 97.48,73.68 97.48,71.92 98.73,70.67
  Bottom Layer w0.254: v1(91.33,82.42) 91.33,81.78 93.05,80.07 v1(93.05,76.78)
IN-D5: length 19.4
  Top Layer w0.254: 98.73,73.21 98.73,73.67 97.42,74.98 97.42,76.25 96.62,77.04 95.35,77.04 v1(94.71,77.68)
  Top Layer w0.508: v1(90.6,84.39) 90.2,83.99 N1.14
  Bottom Layer w0.254: v1(94.71,77.68) 94.71,84.28 94.3,84.69 90.88,84.69 90.59,84.4
IN-WR: length 40.6
  Top Layer w0.254: 94.01,82.63 N1.11 ; 94.01,82.63 94.01,81.05 93.5,80.54 82.3,80.54 80.87,81.96 80.87,83.88 79.1,85.66 72.4,85.66 70.85,84.11 M1.15 ; 94.01,82.63 94.63,82 95.69,82 95.7,82.01 96.67,82.01 96.68,82 96.89,82 97.48,81.41 97.48,77.59 98.73,76.35 98.73,75.75
OP-IN: length 29.6
  Top Layer w0.508: 50.7,80.06 50.7,67.94 51.22,67.41 55.22,67.41 56.47,68.66 62.39,68.66 63.23,69.5 M1.4
OP-OUT: length 10.6
  Top Layer w0.508: M1.2 60.69,70.88 59.97,70.17 55.04,70.17 53.52,68.65
$1N2485: length 44.8
  Top Layer w0.508: 20.42,74.14 R5.1 ; 20.42,74.14 20.42,71.54 arc(20.57,71.19) 20.91,71.05 U2.2 ; 20.42,74.14 arc(20.61,73.7) 21.04,73.52 29.07,73.52 arc(30.07,73.11) 30.49,72.1 30.49,71.42 arc(30.63,71.09) 30.96,70.95 RF-P.1 arc(32.27,71.67) 32.1,72.52 RD.1 ; RD.1 35.68,88.1 arc(35.82,88.04) 100pF#5.1 ; RD.1 RF.1
$1N2698: length 11.6
  Top Layer w1.27: U4.5 7.78,88.24 7.85,88.18 7.85,85.64 11.75,85.64 100pF.1
$1N2704: length 2.1
  Top Layer w0.508: 100pF.2 13.58,87.61 arc(13.73,87.55) R1.1
$1N2710: length 2.2
  Top Layer w0.508: 100pF#2.2 13.64,78.48 arc(13.78,78.42) R2.1
$1N2715: length 11.7
  Top Layer w1.27: U3.5 7.67,79.1 7.86,78.91 7.86,76.37 11.67,76.37 100pF#2.1
$1N2721: length 11.6
  Top Layer w1.27: 2.76,69.96 7.8,69.96 7.86,69.9 7.86,67.36 11.77,67.36
$1N2730: length 2.2
  Top Layer w0.508: 100pF#3.2 13.69,69.36 arc(13.83,69.3) R3.1
$1N2778: length 17.4
  Top Layer w0.508: 16.1,63.57 R4.2 22.4,63.57 arc(20.99,64.15) 20.4,65.57 20.4,68.96 arc(20.64,69.54) 21.22,69.78 U2.3
$1N2863: length 6.6
  Top Layer w0.508: 25.28,77.36 21.68,77.36 arc(22.21,77.14) 22.42,76.61 R5.2
$1N2871: length 38.7
  Top Layer w0.508: 19.86,63.57 R3.2 16.39,67.15 arc(18.19,67.9) 18.93,69.69 18.93,76.73 ; 18.93,76.73 18.93,77.73 ; 18.93,76.73 arc(18.55,76.4) 18.06,76.28 R2.2 ; 19.14,77.73 19.14,82.87 arc(18.4,84.67) 16.6,85.41 R1.2
$1N3268: length 14.8
  Top Layer w1.27: U7.5 22.95,97.41 22.95,95.37 arc(22.97,93.73) C4.2 27.72,92.09 arc(28.68,92.49) 29.08,93.45 31.62,93.45
$1N3280: length 44.3
  Top Layer w0.508: C4.1 28.29,90.09 arc(28.3,90.09) 28.3,90.1 arc(28.3,90.1) RF.2 RD.2 35.68,90.1 arc(35.82,90.04) 100pF#5.2 arc(37.17,89.36) 37.7,88.08 37.7,86.98 arc(37.21,85.79) 36.02,85.3 arc(35.83,85.29) 35.65,85.26 arc(34.58,84.82) 34.14,83.75 34.14,69.84 arc(33.73,68.86) RF-P.2 arc(32.36,69.39) 31.42,69.78 U2.6
$1N3511: length 11.6
  Top Layer w1.27: 7.85,60.87 7.79,60.81 2.76,60.81 ; 7.85,60.87 7.85,58.33 ; 7.85,60.87 11.72,60.87 100pF#4.1
$1N3515: length 2.1
  Top Layer w0.508: 100pF#4.2 13.86,58.81 arc(13.88,58.82) R7.1
$1N3520: length 2.9
  Top Layer w0.254: R7.2 13.89,63.24 13.56,63.57
$1N3998: length 2.4
  Top Layer w0.508: R9.1 38.78,52.32 39.05,52.59
$1N4082: length 2.5
  Top Layer w0.508: R10.1 14.28,52.55 LED2.2
$2N1385: length 19.4
  Top Layer w0.508: M1.3 61.96,74.83 61.1,75.69 58.86,75.69 58.29,75.12 58.29,73.89 57.67,73.27 55.22,73.27 P2.5
  Bottom Layer w0.254: P2.5 53.55,74.74 52.23,73.43 49.7,73.43 48.16,74.98
$2N1386: length 14.4
  Top Layer w0.254: 48.16,80.06 49.76,81.66 51.91,81.66 P2.1
  Top Layer w0.508: P2.1 53.55,80.36 arc(54.29,82.15) 56.09,82.9 M1.24
$2N1387: length 18.8
  Top Layer w0.508: P2.3 52.2,76.13 52.2,74.08 53.98,72.3 58.31,72.3 M1.1
  Bottom Layer w0.254: 48.16,77.52 49.41,76.26 52.33,76.26 P2.3
$2N1398: length 7.7
  Top Layer w0.508: M1.20 64.5,85.23 64.88,85.61 66.57,85.61 68.51,87.55 H1.5
$2N1399: length 7.1
  Top Layer w0.508: H1.3 65.97,87.16 65.41,86.6 63.94,86.6 63.23,85.89 M1.21
$2N1463: length 11.3
  Top Layer w0.508: M1.18 67.02,82.87 67.02,80.88 68.41,79.49 X1.3
$2N4736: length 5.7
  Top Layer w0.508: M1.22 61.96,86.51 H1.1
$2N4759: length 10.7
  Top Layer w0.508: H1.6 H1.4 H1.2 64.48,91.58 64.48,95.69
$2N7298: length 9
  Top Layer w0.508: 56.47,66.12 53.52,66.11 arc(54.6,63.3) A-OUT.5
$2N7530: length 5.7
  Top Layer w0.508: 100nF#5.2 54.97,90.41 B-IN.5
$2N7539: length 22.1
  Top Layer w0.508: 100nF#5.1 58.15,90.09 arc(59.94,89.35) 60.69,87.55 M1.23 60.69,81.1 59.6,80.02 P2.2 P2.4 P2.6
$2N7543: length 19.6
  Top Layer w0.508: X1.1 77.39,76.91 76,75.52 72.76,75.52 72.12,74.88 M1.11 72.12,71.44 arc(72.33,70.42) 72.93,69.57 arc(75.95,67.3) CLK-IN.5
$2N8327: length 10.5
  Top Layer w0.508: 100nF#6.1 64.56,60.39 64.48,60.31 arc(67.25,60.52) 69.96,61.16
$2N8341: length 6.2
  Top Layer w0.508: M1.5 64.5,67.28 100nF#6.2
$3N1782: length 12.6
  Top Layer w0.254: RL1.2 RB1.2 RH1.2 53.69,26.81 ; 52.77,23.88 53.7,24.81 R22.2
$3N1872: length 59.5
  Top Layer w0.254: RL5.1 56.69,30.64 R42.1 ; v1(60.58,27.7) 62.29,27.7 R52.2 63.96,23.93 63.18,23.16 63.18,22.51 62.6,21.93 51.92,21.93 51.41,21.43 51.41,4.77 50.41,3.76 RL2.2
  Bottom Layer w0.254: v1(60.58,27.7) 57.35,30.93 v1(57.35,31.4)
$3N1876: length 44.5
  Top Layer w0.254: RB5.1 56.61,28.72 R32.1 56.61,27.81 56.61,23.55 55.64,22.58 51.33,22.58 50.85,22.1 50.85,6.7 49.76,5.61 RB2.2
$3N1878: length 41.1
  Top Layer w0.254: RH5.1 60.06,30.49 v1(57.2,27.63) ; RH2.2 40.53,7.91 49.42,7.91 50.21,8.7 50.21,22.56 50.83,23.18 52.72,23.18 52.77,23.23 54.99,23.23 55.7,23.93 R22.1
  Bottom Layer w0.254: v1(55.37,24.94) 55.37,25.8 v1(57.2,27.63)
$3N2477: length 21.1
  Top Layer w0.254: 89.84,29.58 90.04,29.78 RG2.2
  Top Layer w0.508: CO2.2 89.84,29.58 89.84,32.98 87,35.82 VOUT2.5 81.83,30.94 AD8605.1
$3N2576: length 29.4
  Top Layer w0.254: H4.2 74.35,36.2 74.35,28.77 76.98,26.14 81.88,26.14 83.3,27.57 AD8605.4 84.37,26.84 87.2,26.84 87.84,27.47 CO2.1 87.84,29.58 87.84,31.53
$3N2792: length 17.3
  Top Layer w0.254: RH5.2 RB5.2 RL5.2
  Top Layer w0.381: H4.1 H4.3 72.3,34.16 RL5.2
$3N2807: length 12.3
  Top Layer w0.254: AD8605.3 79.72,26.93 77.5,26.93 75.53,28.9 H4.8 H4.6 H4.4
$3N3003: length 42.7
  Top Layer w0.254: R21.2 39.81,28.76 40.29,28.29 40.29,26.58 43.64,23.23 U36.2 46.84,23.23 46.94,23.33 46.94,36.75 48.59,38.41 57.04,38.41 57.62,37.83 57.62,34.44 RH1.1
$3N3008: length 38.3
  Top Layer w0.254: RB1.1 55.85,34.33 57.03,35.52 57.03,37.35 56.51,37.88 49,37.88 47.58,36.46 47.58,22.91 47.23,22.56 45.63,22.56 U36.3 43,22.58 R31.2
$3N3018: length 42.5
  Top Layer w0.254: R51.2 34.04,22.92 33.58,22.45 36.07,22.45 R41.2 39.29,25.06 42.42,21.93 U36.4 47.34,21.93 48.18,22.77 48.18,35.96 49.51,37.29 54.53,37.29 RL1.1
$3N3022: length 31.8
  Top Layer w0.254: U36.1 44.5,23.88 41.05,27.32 41.05,29.41 40.38,30.08 37.85,30.08 36.67,28.91 R21.1
  Top Layer w0.508: R11.2 35.54,29.23 arc(36.15,29.11) R21.1 R31.1 R41.1
$3N3099: length 4.1
  Top Layer w0.508: R11.1 20.35,27.23 ; 20.35,27.23 CI1.2 ; 20.35,27.23 18.29,27.23
$3N3340: length 20.6
  Top Layer w0.254: U36.5 42.09,21.28 41.54,21.82 33.28,21.82 31.95,23.16 SB.2 31.04,24.52 R61.2 32,25.7 R51.1
$3N3779: length 59.9
  Top Layer w0.254: v1(47.5,18.31) 47.22,18.03 U36.10 43.82,18.03 41.94,16.15 33,16.15 SA.2 ; v1(48.9,0.63) 48.97,0.69 57.14,0.69 58.98,2.53 58.98,6.63 60.85,8.51 62.93,8.51 R53.2 R63.2
  Bottom Layer w0.254: v1(48.9,0.63) 48.9,17.27 47.86,18.31 v1(47.5,18.31)
$3N4162: length 56.9
  Top Layer w0.254: v1(48.25,3.08) 48.55,2.78 55.42,2.78 v1(55.89,3.25) 56.34,3.7 56.34,4.16 ; v1(57.74,7.78) 59.63,9.67 R53.1 ; v1(48.16,16.92) 47.68,17.4 47.02,17.4 47.01,17.4 45.63,17.4 U36.11 44.09,17.38 R43.2 38.28,15.19 31.43,15.19 SA.1
  Bottom Layer w0.254: v1(48.25,3.08) 48.16,3.17 v1(48.16,16.92) ; v1(57.74,7.78) 57.74,5.1 v1(55.89,3.25)
$3N4167: length 38.8
  Top Layer w0.254: R33.2 40.62,11.47 41.37,12.22 41.37,13.61 44.48,16.73 U36.12 45.66,16.77 v1(47.3,16.77) ; v1(47.27,2.73) 47.39,2.73 47.89,2.22 56.7,2.22 57.5,3.03 57.5,5.32 57.24,5.58 RB3.1
  Bottom Layer w0.254: v1(47.3,16.77) 47.49,16.59 47.49,2.94 v1(47.27,2.73)
$3N4172: length 43
  Top Layer w0.254: v1(46.9,15.89) 46.72,16.08 U36.13 44.77,16.08 42.19,13.5 42.19,11.72 R23.2 ; RH3.1 57.27,7.38 58.2,6.45 58.2,2.68 56.95,1.44 47.21,1.44 v1(46.54,2.1)
  Bottom Layer w0.254: v1(46.9,15.89) 46.54,15.54 v1(46.54,2.1)
$3N4596: length 12.4
  Top Layer w0.254: 52.77,15.43 52.78,15.45 53.67,15.45 54.34,14.78 R24.2 54.34,11.22 ; 54.34,4.16 RB3.2 RH3.2 R44.2 R34.2
$3N4603: length 24.6
  Top Layer w0.254: 62.16,3.76 60.97,3.76 v1(60.87,3.86) ; 52.77,17.38 58.76,17.38 JPD.1 58.92,17.22 58.92,11.92 v1(57.37,10.37) 56.34,9.34 R44.1
  Bottom Layer w0.254: v1(57.37,10.37) 59.41,8.33 59.41,5.31 v1(60.87,3.86)
$3N4605: length 16.9
  Top Layer w0.254: 56.34,14.72 v1(56.66,15.04) ; 56.34,14.72 56.34,14.74 55,16.08 52.77,16.08 ; 56.34,14.72 R24.1 ; v1(60.94,7.59) 61.14,7.39 62.16,7.39
  Bottom Layer w0.254: v1(56.66,15.04) 60.96,10.73 60.96,7.62 v1(60.94,7.59)
$3N4661: length 19.7
  Top Layer w0.254: R34.1 57.38,12.13 v1(57.38,12.77) 57.38,15.54 56.2,16.73 52.77,16.73 ; 62.16,5.61 62.14,5.64 v1(61.22,5.64)
  Bottom Layer w0.254: v1(61.22,5.64) 60.25,6.61 60.25,9.79 57.38,12.65 v1(57.38,12.77)
$3N4969: length 32.7
  Top Layer w0.406: 200R.2 52.8,19.3 52.77,19.33
$3N4977: length 13.9
  Top Layer w0.254: R54.2 R64.1 62.13,16.55 JPD.2 60.18,18.5 57.64,18.5 57.17,18.03 52.77,18.03
$3N5437: length 19.1
  Top Layer w0.254: CO1.2 90.04,6.3 RG1.2
  Top Layer w0.508: 89.98,8.24 89.98,9.3 86.87,12.41 81.69,12.41 VOUT1.5 81.68,7.44 80.77,6.53
$3N5450: length 29.3
  Top Layer w0.254: RG1.1 88.04,6.3 CO1.1 87.84,4.59 87.06,3.82 84.19,3.82 AD8605#2.4 83.37,2.96 81.77,1.36 75.52,1.36 74.4,2.48 74.4,8.73 75.79,10.11 75.79,10.57
$3N5465: length 11.4
  Top Layer w0.254: 75.79,2.95 80.13,2.95 80.56,3.39 80.56,4.43 AD8605#2.3 ; H6.4 H6.6 H6.8
$3N5493: length 15
  Top Layer w0.254: RH4.2 RB4.2 64.16,4.26
  Top Layer w0.381: 73.25,10.57 73.25,8.03 72.6,7.39 RH4.2
$3N5834: length 5.5
  Top Layer w0.508: CLK.5 92.91,19.29 87.46,19.29 200R.1
$3N6100: length 13.3
  Top Layer w0.254: 52.77,21.28 54.53,21.28 ; R52.1 61.93,26.06 R62.1 60.64,25.72 60.64,23.16
  Bottom Layer w0.254: v1(54.59,21.32) 55.23,21.95 59.43,21.95 60.64,23.16
$3N6540: length 39.8
  Top Layer w0.254: U36.14 44.97,15.43 42.81,13.26 42.81,10.68 40.62,8.48 39.38,8.48 38.24,9.62 R23.1
  Top Layer w0.508: 20.35,13.51 37.77,13.51 arc(37.94,13.48) R43.1 R33.1 R23.1 RH2.1 RB2.1 RL2.1

## Copper pours and planes (outline as drawn; the poured copper is in the pictures)
+5V on Top Layer: 24.96,71.48 28.96,71.48 28.96,61.32 24.96,61.32
-5V on Top Layer: 21.22,68.85 25.03,68.85 25.03,60.09 21.22,60.09
GND on Top Layer: 44.76,100.58 102.61,100.58 102.61,42.91 44.76,42.91
GND on Top Layer: 0.16,41.8 100,41.8 100,-1.17 0.16,-1.17
GND on Top Layer: 0.09,99.9 44.01,99.9 44.01,42.5 0.09,42.5
GND on Bottom Layer: 0.05,99.98 43.96,99.98 43.96,42.64 0.05,42.64
GND on Bottom Layer: -3.72,41.74 109.77,41.74 109.77,-1.23 -3.72,-1.23
GND on Bottom Layer: 44.68,100.08 102.53,100.08 102.53,42.72 44.68,42.72
GND on Inner1: 44.72,100.26 102.57,100.26 102.57,42.9 44.72,42.9
GND on Inner1: 0.03,100.07 43.95,100.07 43.95,42.67 0.03,42.67
GND on Inner1: 0.19,41.79 100.02,41.79 100.02,-1.17 0.19,-1.17
GND on Inner2: 44.85,100.68 102.7,100.68 102.7,43.01 44.85,43.01
GND on Inner2: 0.16,99.98 44.07,99.98 44.07,42.58 0.16,42.58
GND on Inner2: -0.12,41.6 99.72,41.6 99.72,-1.37 -0.12,-1.37

Small or netless copper shapes (teardrops, artwork), in the pictures only: 483 on Top Layer, 53 on Bottom Layer, 4 on Inner2

## Text on the board
Top Silkscreen Layer: JPB | JP1 | JPA | SB | -5V | LPD | AGND | LPB | LPC | 非差分RD不贴 | RF | RD | GND | VOUT | VCC | VEE | JP3A | JP3B | JP3C | JP3D | JP2A | JP2B | JP2C | JP2D | LPA | BPA | HPA | OUTA | INB | OUTB | BPB | HPB | DUAL同向10100 | DUAL反向R1001
